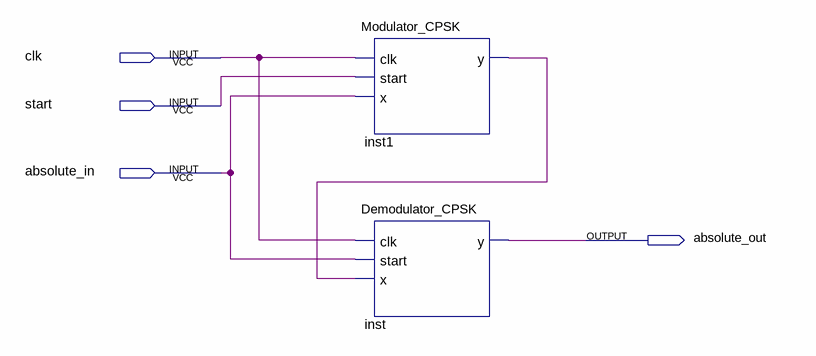
[diagram p0: schematic sheet]
// Quartus schematic PSK_top.bdf as structural Verilog: 2 symbols, 4 pins
module PSK_top (
  input  clk,
  input  start,
  input  absolute_in,
  output absolute_out
);

  wire inst1_y;

  Modulator_CPSK inst1 (.clk(clk), .start(start), .x(absolute_in), .y(inst1_y));
  Demodulator_CPSK inst (.clk(clk), .start(absolute_in), .x(inst1_y), .y(absolute_out));
endmodule
